# EAGLE design PersiBT (EAGLE 9.1.3)
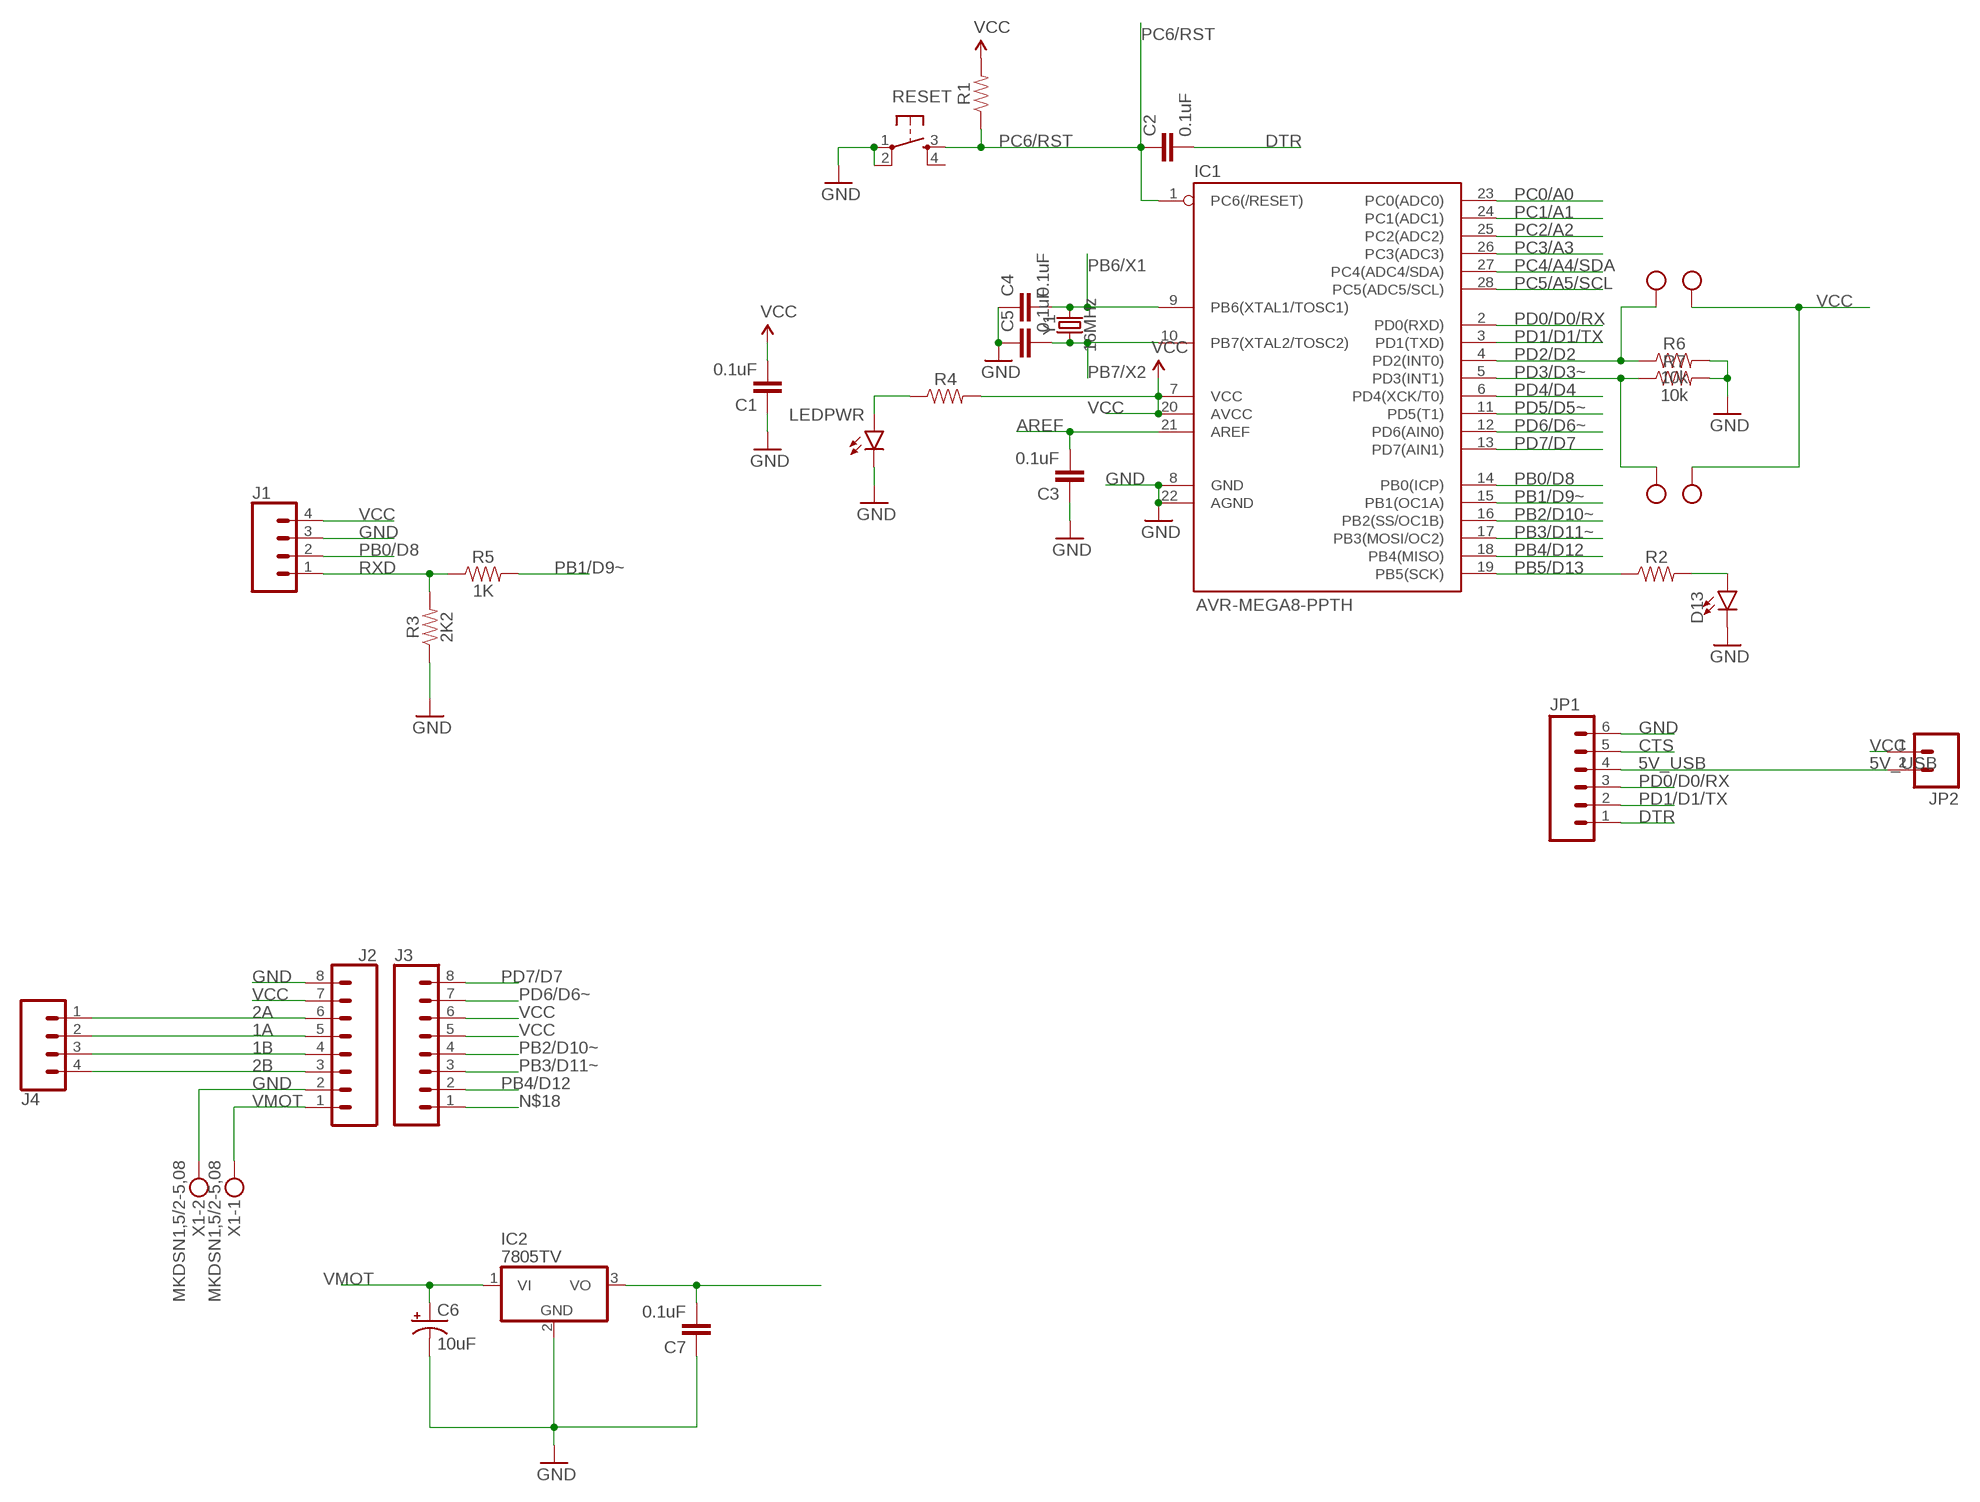
[diagram p0: schematic, sheet 1]

## Parts
C1  0.1uF  0.1UF-KIT-EZ-50V-20%  [CAP-PTH-SMALL-KIT]
C2  0.1uF  0.1UF-KIT-EZ-50V-20%  [CAP-PTH-SMALL-KIT]
C3  0.1uF  0.1UF-KIT-EZ-50V-20%  [CAP-PTH-SMALL-KIT]
C4  0.1uF  0.1UF-KIT-EZ-50V-20%  [CAP-PTH-SMALL-KIT]
C5  0.1uF  0.1UF-KIT-EZ-50V-20%  [CAP-PTH-SMALL-KIT]
C6  10uF  10UF-POLAR-RADIAL-2.5MM-KIT-25V-20%  [CPOL-RADIAL-2.5MM-5MM-KIT]
C7  0.1uF  0.1UF-KIT-EZ-50V-20%  [CAP-PTH-SMALL-KIT]
D13  LED5MM-KIT  [LED_5MM-KIT]
IC1  AVR-MEGA8-PPTH  [DIL28-3]
IC2  7805TV  [TO220V]
J1  CONN_04  [1X04]
J2  CONN_08"  [1X08]
J3  CONN_08"  [1X08]
J4  CONN_04  [1X04]
JP1  M06SIP  [1X06]
JP2  M02PTH  [1X02]
LEDPWR  LED5MM-KIT  [LED_5MM-KIT]
R1  RESISTORAXIAL-0.3-KIT  [AXIAL-0.3-KIT]
R2  RESISTORAXIAL-0.3-KIT  [AXIAL-0.3-KIT]
R3  2K2  RESISTORAXIAL-0.3-KIT  [AXIAL-0.3-KIT]
R4  RESISTORAXIAL-0.3-KIT  [AXIAL-0.3-KIT]
R5  1K  RESISTORAXIAL-0.3-KIT  [AXIAL-0.3-KIT]
R6  10k  RESISTORAXIAL-0.3-KIT  [AXIAL-0.3-KIT]
R7  10k  RESISTORAXIAL-0.3-KIT  [AXIAL-0.3-KIT]
RESET  TAC_SWITCHPTH  [TACTILE-PTH]
X1  MKDSN1,5/2-5,08  [MKDSN1,5/2-5,08]
X2  MKDSN1,5/2-5,08  [MKDSN1,5/2-5,08]
X3  MKDSN1,5/2-5,08  [MKDSN1,5/2-5,08]
Y1  16MHz  CRYSTAL-16MHZPTH-HC49US  [HC49US]

## Nets
1A: J2.5 J4.2
1B: J2.4 J4.3
2A: J2.6 J4.1
2B: J2.3 J4.4
5V_USB: JP1.4 JP2.2
AREF: C3.2 IC1.21(AREF)
CTS: JP1.5
DTR: C2.2 JP1.1
GND: C1.1 C3.1 C4.1 C5.1 C6.2(-) C7.1 D13.K(C) IC1.8(GND) IC1.22(AGND) IC2.2(GND) J1.3 J2.2 J2.8 JP1.6 LEDPWR.K(C) R3.P$1 R6.P$2 R7.P$2 RESET.1 RESET.2 X1.2
N$1: D13.A R2.P$2
N$2: LEDPWR.A R4.P$1
N$18: J3.1
PB0/D8: IC1.14(PB0(ICP)) J1.2
PB1/D9~: IC1.15(PB1(OC1A)) R5.P$2
PB2/D10~: IC1.16(PB2(SS/OC1B)) J3.4
PB3/D11~: IC1.17(PB3(MOSI/OC2)) J3.3
PB4/D12: IC1.18(PB4(MISO)) J3.2
PB5/D13: IC1.19(PB5(SCK)) R2.P$1
PB6/X1: C4.2 IC1.9(PB6(XTAL1/TOSC1)) Y1.2
PB7/X2: C5.2 IC1.10(PB7(XTAL2/TOSC2)) Y1.1
PC0/A0: IC1.23(PC0(ADC0))
PC1/A1: IC1.24(PC1(ADC1))
PC2/A2: IC1.25(PC2(ADC2))
PC3/A3: IC1.26(PC3(ADC3))
PC4/A4/SDA: IC1.27(PC4(ADC4/SDA))
PC5/A5/SCL: IC1.28(PC5(ADC5/SCL))
PC6/RST: C2.1 IC1.1(PC6(/RESET)) R1.P$1 RESET.3
PD0/D0/RX: IC1.2(PD0(RXD)) JP1.3
PD1/D1/TX: IC1.3(PD1(TXD)) JP1.2
PD2/D2: IC1.4(PD2(INT0)) R6.P$1 X2.1
PD3/D3~: IC1.5(PD3(INT1)) R7.P$1 X3.2
PD4/D4: IC1.6(PD4(XCK/T0))
PD5/D5~: IC1.11(PD5(T1))
PD6/D6~: IC1.12(PD6(AIN0)) J3.7
PD7/D7: IC1.13(PD7(AIN1)) J3.8
RXD: J1.1 R3.P$2 R5.P$1
VCC: C1.2 C7.2 IC1.7(VCC) IC1.20(AVCC) IC2.3(VO) J1.4 J2.7 J3.5 J3.6 JP2.1 R1.P$2 R4.P$2 X2.2 X3.1
VMOT: C6.1(+) IC2.1(VI) J2.1 X1.1
Unconnected: RESET.4

## Library data of the parts
C1-C5 C7 = SparkFun-Capacitors:0.1UF: 0.1µF ceramic capacitors A capacitor is a passive two-terminal electrical component used to store electrical energy temporarily in an electric field.; PROD_ID: CAP-08370
C6 = SparkFun-Capacitors:10UF-POLAR: 10.0µF polarized capacitors A capacitor is a passive two-terminal electrical component used to store electrical energy temporarily in an electric field.; PROD_ID: CAP-08440
D13 LEDPWR = SparkFun-LED:LED: LED (Generic) Standard schematic elements and footprints for 5mm, 3mm, 1206, and 0603 sized LEDs. Generic LEDs with no color specified.
IC1 = SparkFun-DigitalIC:AVR-MEGA8-P: MICROCONTROLLER 8 Kbytes FLASH 1 kbytes SRAM 512 bytes EEPROM USART 4-channel 10 bit ADC 2-channel 8 bit ADC
IC2 = linear:78*: Positive VOLTAGE REGULATOR Source: http://cache.national.com/ds/LM/LM78L05.pdf http://www.fairchildsemi.com/ds/LM/LM7805.pdf
J1 J4 = SparkFun-Connectors:CONN_04: Multi connection point. Often used as Generic Header-pin footprint for 0.1 inch spaced/style header connections On any of the 0.1 inch spaced packages, you can populate with these: Break Away Headers - Straight <https://www.sparkfun.com/products/116> (PRT-00116) Break Away Male Headers - Right Angle <https://www.sparkfun.com/products/553> (PRT-00553) Female Headers <https://www.sparkfun.com/products/115> (PRT-00115) Break Away Headers - Machine Pin <https://www.sparkfun.com/products/117> (PRT-00117) Break Away Female Headers - Swiss Machine Pin <https://www.sparkfun.com/products/743> (PRT-00743) For SCREWTERMINALS and SPRING TERMINALS visit here: Screw Terimnals on SparkFun.com <https://www.sparkfun.com/search/results?term=Screw+Terminals> (5mm/3.5mm/2.54mm spacing) This device is also useful as a general connection point to wire up your design to another part of your project. Our various solder wires solder well into these plated through hole pads. Hook-Up Wire - Assortment (Stranded, 22 AWG) <https://www.sparkfun.com/products/11375> (PRT-11375) Hook-Up Wire - Assortment (Solid Core, 22 AWG) <https://www.sparkfun.com/products/11367> (PRT-11367) View the entire wire category on our website here <https://www.sparkfun.com/categories/141> Special notes: Molex polarized connector foot print use with SKU : PRT-08231 with associated crimp pins and housings. 1MM SMD Version SKU: PRT-10208; PROD_ID: CONN-09696
J2 J3 = SparkFun-Connectors:CONN_08: Multi connection point. Often used as Generic Header-pin footprint for 0.1 inch spaced/style header connections On any of the 0.1 inch spaced packages, you can populate with these: Break Away Headers - Straight <https://www.sparkfun.com/products/116> (PRT-00116) Break Away Male Headers - Right Angle <https://www.sparkfun.com/products/553> (PRT-00553) Female Headers <https://www.sparkfun.com/products/115> (PRT-00115) Break Away Headers - Machine Pin <https://www.sparkfun.com/products/117> (PRT-00117) Break Away Female Headers - Swiss Machine Pin <https://www.sparkfun.com/products/743> (PRT-00743) Arduino Stackable Header - 8 Pin <https://www.sparkfun.com/products/9279> (PRT-09279) For SCREWTERMINALS and SPRING TERMINALS visit here: Screw Terimnals on SparkFun.com <https://www.sparkfun.com/search/results?term=Screw+Terminals> (5mm/3.5mm/2.54mm spacing) This device is also useful as a general connection point to wire up your design to another part of your project. Our various solder wires solder well into these plated through hole pads. Hook-Up Wire - Assortment (Stranded, 22 AWG) <https://www.sparkfun.com/products/11375> (PRT-11375) Hook-Up Wire - Assortment (Solid Core, 22 AWG) <https://www.sparkfun.com/products/11367> (PRT-11367) View the entire wire category on our website here <https://www.sparkfun.com/categories/141> Special notes: Molex polarized connector foot print use with SKU : PRT-08231 with associated crimp pins and housings. 1MM SMD Version SKU: PRT-10208 NOTES ON THE VARIANTS LOCK and LOCK_LONGPADS... This footprint was designed to help hold the alignment of a through-hole component (i.e. 6-pin header) while soldering it into place. You may notice that each hole has been shifted either up or down by 0.005 of an inch from it's more standard position (which is a perfectly straight line). This slight alteration caused the pins (the squares in the middle) to touch the edges of the holes. Because they are alternating, it causes a "brace" to hold the component in place. 0.005 has proven to be the perfect amount of "off-center" position when using our standard breakaway headers. Although looks a little odd when you look at the bare footprint, once you have a header in there, the alteration is very hard to notice. Also,if you push a header all the way into place, it is covered up entirely on the bottom side.; PROD_ID: CONN-08438
JP1 = SparkFun:M06: Header 6 Standard 6-pin 0.1" header. Use with straight break away headers (SKU : PRT-00116), right angle break away headers (PRT-00553), swiss pins (PRT-00743), machine pins (PRT-00117), and female headers (PRT-00115). Molex polarized connector foot print use with SKU : PRT-08094 with associated crimp pins and housings. NOTES ON THE VARIANTS LOCK and LOCK_LONGPADS... This footprint was designed to help hold the alignment of a through-hole component (i.e. 6-pin header) while soldering it into place. You may notice that each hole has been shifted either up or down by 0.005 of an inch from it's more standard position (which is a perfectly straight line). This slight alteration caused the pins (the squares in the middle) to touch the edges of the holes. Because they are alternating, it causes a "brace" to hold the component in place. 0.005 has proven to be the perfect amount of "off-center" position when using our standard breakaway headers. Although looks a little odd when you look at the bare footprint, once you have a header in there, the alteration is very hard to notice. Also, if you push a header all the way into place, it is covered up entirely on the bottom side. This idea of altering the position of holes to aid alignment will be further integrated into the Sparkfun Library for other footprints. It can help hold any component with 3 or more connection pins.
JP2 = SparkFun:M02: Header 2 Standard 2-pin 0.1" header. Use with straight break away headers (SKU : PRT-00116), right angle break away headers (PRT-00553), swiss pins (PRT-00743), machine pins (PRT-00117), and female headers (PRT-00115). Molex polarized connector foot print use with SKU : PRT-08233 with associated crimp pins and housings.
R1-R7 = SparkFun-Resistors:RESISTOR: Generic Resistor Package
RESET = SparkFun-Electromechanical:TAC_SWITCH: Momentary Switch Button commonly used for reset or general input. Spark Fun Electronics SKU : COM-00097
X1-X3 = con-phoenix-508:MKDSN1,5/2-5,08: MKDSN 1,5/ 2-5,08 Printklemme Nennstrom: 13,5 A Nennspannung: 250 V Rastermaß: 5,08 mm Polzahl: 2 Anschlussart: Schraubanschluss Montage: Löten Anschlussrichtung Leiter/Platine: 0 ° Artikelnummer: 1729128 Source: http://eshop.phoenixcontact.com .. 1729128.pdf
Y1 = SparkFun-Clocks:CRYSTAL-16MHZ: 16MHz Crystal Digikey Example <http://www.digikey.com/product-search/en?keywords=535-9122-1-ND> Frequency: 16MHz Frequency Stability: ±50ppm Frequency Tolerance: ±20ppm Load Capacitance: 18pF SparkFun Products: Pro Micro -5V/16MHz <https://www.sparkfun.com/products/12640> SparkFun Serial Enabled LCD Kit <https://www.sparkfun.com/products/10097>; PROD_ID: XTAL-08181; SF_ID: COM-00536

## Net classes
0 default: width 0.61 mm, drill 0.9 mm, clearance 0.203 mm

## Board
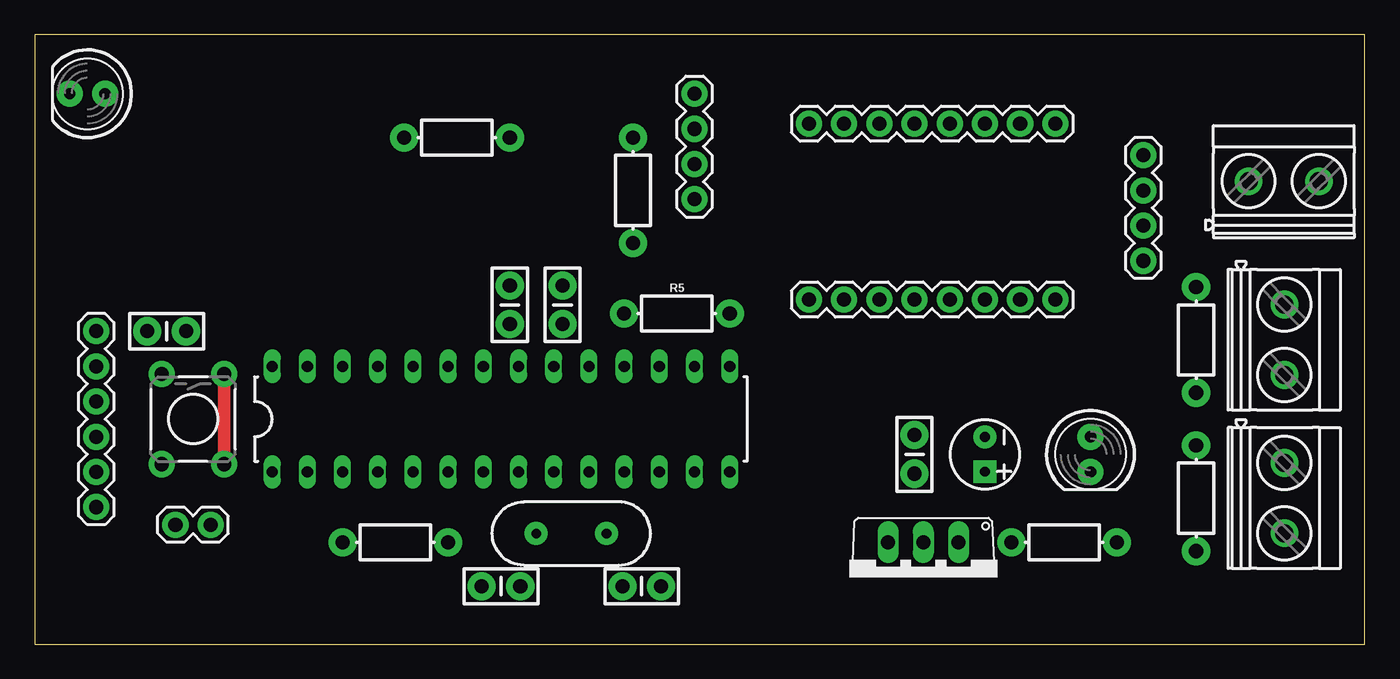
[diagram p1: board, top side]
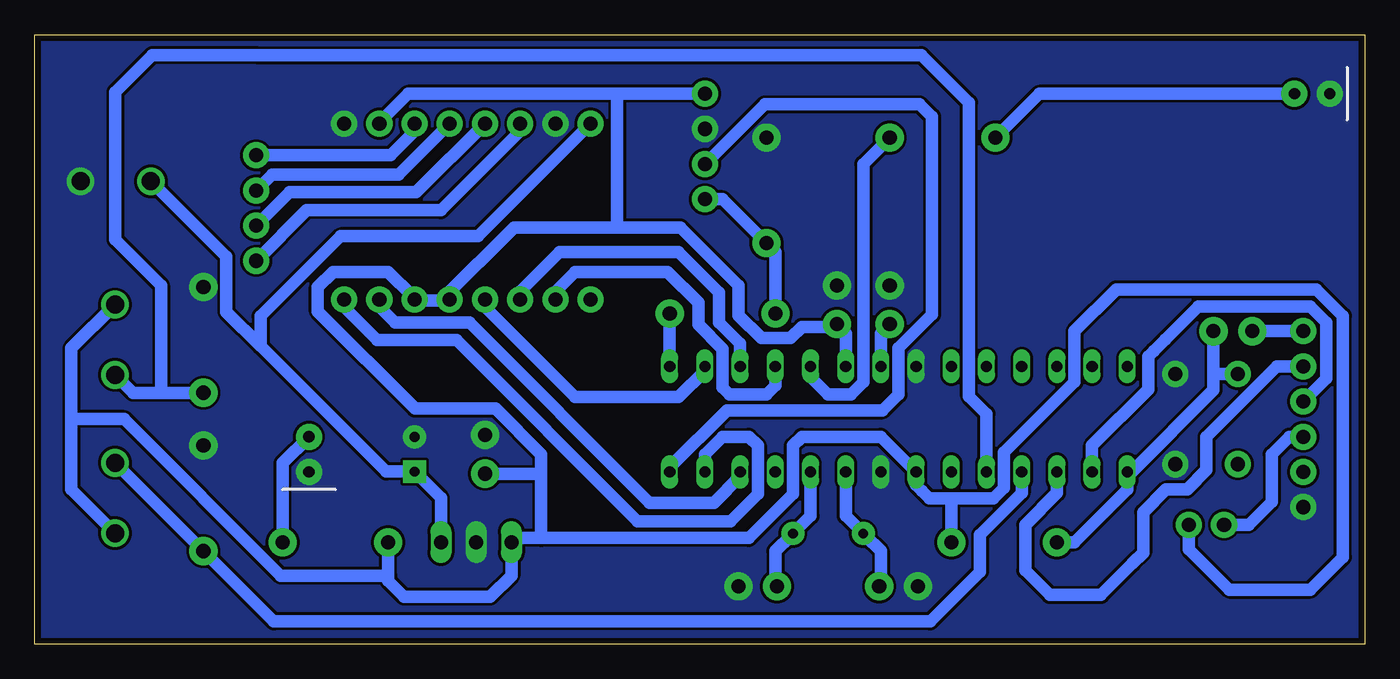
[diagram p2: board, bottom side, seen from below]

Size 96 x 44 mm. Coordinates in mm from the lower left corner, seen from the top.
Outline: 0,0 96,0 96,44 0,44 0,0
Copper layers (1*16): Top 0.017mm / dielectric 1.566mm / Bottom 0.017mm
Design rules "default": minimum track width 4mil, minimum drill 8mil, track to track 4mil, track to pad 4mil, pad to pad 4mil, via to via 4mil, smd to smd 4mil, copper to edge 18mil, drill to drill 9mil, minimum pad ring 5mil, minimum via ring 5mil, stop-mask expansion 2.5mil, vias tented up to drill 0mil, thermal gap 10mil

### Footprints (pad centres in the part's own frame; a part is rotated, then mirrored left to right if it is on the bottom)
CAP-PTH-SMALL-KIT = drill 1.016 pad 2.032: 1 -1.397,0; 2 1.397,0
CPOL-RADIAL-2.5MM-5MM-KIT = drill 0.7 pad 1.651 square: 1 1.25,0 | drill 0.7 pad 1.651: 2 -1.25,0
LED_5MM-KIT = drill 0.813 pad 1.88: A -1.27,0; K 1.27,0
DIL28-3 = drill 0.813 long: 1 -16.51,-3.81; 2 -13.97,-3.81; 3 -11.43,-3.81; 4 -8.89,-3.81; 5 -6.35,-3.81; 6 -3.81,-3.81; 7 -1.27,-3.81; 8 1.27,-3.81; 9 3.81,-3.81; 10 6.35,-3.81; 11 8.89,-3.81; 12 11.43,-3.81; 13 13.97,-3.81; 14 16.51,-3.81; 15 16.51,3.81; 16 13.97,3.81; 17 11.43,3.81; 18 8.89,3.81; 19 6.35,3.81; 20 3.81,3.81; 21 1.27,3.81; 22 -1.27,3.81; 23 -3.81,3.81; 24 -6.35,3.81; 25 -8.89,3.81; 26 -11.43,3.81; 27 -13.97,3.81; 28 -16.51,3.81
TO220V = drill 1.016 long: 1 -2.54,-2.54; 2 0,-2.54; 3 2.54,-2.54
1X04 = drill 1.016 pad 1.88: 1 0,0; 2 2.54,0; 3 5.08,0; 4 7.62,0
1X08 = drill 1.016 pad 1.88: 1 0,0; 2 2.54,0; 3 5.08,0; 4 7.62,0; 5 10.16,0; 6 12.7,0; 7 15.24,0; 8 17.78,0
1X06 = drill 1.016 pad 1.88: 1 0,0; 2 2.54,0; 3 5.08,0; 4 7.62,0; 5 10.16,0; 6 12.7,0
1X02 = drill 1.016 pad 1.88: 1 0,0; 2 2.54,0
AXIAL-0.3-KIT = drill 1.016 pad 2.032: P$1 -3.81,0; P$2 3.81,0
TACTILE-PTH = drill 1.016 pad 1.88: 1 -3.251,2.261; 2 3.251,2.261; 3 -3.251,-2.261; 4 3.251,-2.261
MKDSN1,5/2-5,08 = drill 1.3 pad 2: 1 -2.561,0.025; 2 2.519,0.025
HC49US = drill 0.7 pad 1.651: 1 -2.54,0; 2 2.54,0

### Placement (x,y rotation side)
C1  38.1,24.5 270 top
C2  9.53,22.59 180 top
C3  34.29,24.5 270 top
C4  33.66,4.17 0 top
C5  43.81,4.17 180 top
C6  68.58,13.7 270 top
C7  63.5,13.7 270 top
D13  3.81,39.73 180 top
IC1  33.66,16.24 0 top
IC2  64.14,4.81 180 top
J1  47.62,32.11 90 top
J2  55.88,37.58 0 top
J3  55.88,24.88 0 top
J4  80.01,35.29 270 top
JP1  4.45,22.59 270 top
JP2  12.7,8.62 180 top
LEDPWR  76.2,13.7 270 top
R1  26.04,7.35 0 top
R2  30.48,36.56 180 top
R3  43.18,32.75 270 top
R4  74.3,7.35 180 top
R5  46.35,23.86 0 top
R6  83.82,10.53 90 top
R7  83.82,21.95 90 top
RESET  11.43,16.24 270 top
X1  90.17,33.38 0 top
X2  90.17,10.53 270 top
X3  90.17,21.95 270 top
Y1  38.73,7.99 180 top

### Tracks (layer width: path | path; a pad name or v marks a point on that pad's centre or on a via)
1A
  Bottom 0.9: J2.5 69.72,33.89 78.87,33.89 J4.2
1B
  Bottom 0.9: J2.4 68.45,32.62 77.6,32.62 J4.3
2A
  Bottom 0.9: J4.1 70.33,35.29 68.58,37.04 68.58,37.51 J2.6
2B
  Bottom 0.9: J2.3 60.96,37.51 60.96,37.04 66.67,31.32 76.36,31.32 J4.4
5V_USB
  Bottom 0.9: JP1.4 5.46,14.97 6.73,13.7 6.73,10.27 8.38,8.62 JP2.2
AREF
  Bottom 0.9: IC1.21 34.92,22.43 34.29,23.07 C3.2
DTR
  Bottom 0.9: JP1.1 8.1,22.59 C2.2
GND
  Top 0.9: RESET.2 RESET.1
  pour Bottom (no thermals): 0,0 96,0 96,44 0,44
N$1
  Bottom 0.9: D13.A 23.5,39.73 R2.P$2
N$2
  Bottom 0.9: LEDPWR.A 78.11,13.06 R4.P$1
PB0/D8
  Bottom 0.9: IC1.14 50.16,12.75 46.04,16.88 34.8,16.88 33.66,18.02 33.66,21.37 31.24,23.79 31.24,38.08 32.13,38.97 43.31,38.97 J1.2
PB1/D9~
  Bottom 0.9: R5.P$2 IC1.15
PB2/D10~
  Bottom 0.9: IC1.16 47.62,19.73 49.53,17.83 56.99,17.83 63.5,24.34 63.5,24.81 J3.4
PB3/D11~
  Bottom 0.9: J3.3 60.96,25.45 58.1,28.3 49.53,28.3 46.61,25.38 46.61,23.23 45.09,21.7 IC1.17
PB4/D12
  Bottom 0.9: J3.2 58.42,25.45 56.99,26.88 50.32,26.88 48.1,24.65 48.1,23.07 46.35,21.32 46.35,18.53 45.85,18.02 43.18,18.02 42.55,18.65 IC1.18
PB5/D13
  Bottom 0.9: R2.P$1 36.2,34.66 36.2,19.1 36.2,19.09 36.2,18.92 37.1,18.02 38.73,18.02 40.01,19.29 IC1.19
PB6/X1
  Bottom 0.9: IC1.9 37.47,9.26 Y1.2 36.04,7.83 34.92,6.71 34.92,4.17 C4.2
PB7/X2
  Bottom 0.9: IC1.10 40.01,9.26 Y1.1 41.43,7.83 42.55,6.71 42.55,4.17 C5.2
PC6/RST
  Bottom 0.9: C2.1 10.92,19.41 | 10.92,19.41 10.92,18.34 16.83,12.43 IC1.1 17.14,11.16 20.95,7.35 R1.P$1 | RESET.3 10.85,19.49 10.92,19.41
PD0/D0/RX
  Bottom 0.9: 15.24,21.16 14.4,22 | 14.4,22 12.03,24.37 3.94,24.37 2.79,23.23 2.79,19.16 JP1.3 | IC1.2 19.68,14.34 15.62,18.4 15.62,20.78 14.4,22
PD1/D1/TX
  Bottom 0.9: JP1.2 6.35,20.05 11.43,14.97 11.43,12.56 12.83,11.16 14.35,11.16 16,9.51 16,6.59 16.76,5.83 19.05,3.54 22.73,3.54 24.51,5.32 24.51,8.62 22.23,10.91 IC1.3
PD2/D2
  Bottom 0.9: X2.1 R6.P$1 78.74,1.64 31.37,1.64 27.78,5.22 27.78,7.89 24.77,10.91 IC1.4
PD3/D3~
  Bottom 0.9: IC1.5 27.3,16.62 28.57,17.89 28.57,39.1 32,42.53 80.01,42.53 | 80.01,42.53 | R7.P$1 86.74,18.14 | 86.74,18.14 88.9,18.14 X3.2 | 86.74,18.14 86.87,18.27 86.87,25.89 90.17,29.19 90.17,39.86 87.5,42.53 80.01,42.53
PD6/D6~
  Bottom 0.9: IC1.12 45.09,12.11 46.99,10.21 51.63,10.21 64.63,23.21 69.99,23.21 71.12,24.34 J3.7
PD7/D7
  Bottom 0.9: J3.8 73.66,24.81 73.66,24.34 71.28,21.95 65.56,21.95 52.48,8.87 45.78,8.87 43.81,10.84 43.81,14.34 44.45,14.97 46.35,14.97 47.62,13.7 IC1.13
RXD
  Bottom 0.9: J1.1 46.35,32.11 R3.P$2 43.02,28.78 42.55,28.3 R5.P$1
VCC
  Bottom 0.9: IC1.20 37.47,22.43 38.1,23.07 C1.2 38.26,22.91 40.64,22.91 41.47,22.08 43.56,22.08 45.21,23.73 45.21,25.89 49.4,30.08 53.98,30.08 | J2.7 71.12,37.67 69.06,39.73 53.98,39.73 | J1.4 53.98,39.73 | 59.44,7.67 44.45,7.67 41.27,10.84 41.27,14.34 40.64,14.97 34.92,14.97 IC1.7 32.38,11.48 31.97,11.06 31.43,10.53 29.84,10.53 | 59.44,7.67 61.53,7.67 61.59,7.73 IC2.3 61.59,4.94 63.12,3.41 69.34,3.41 70.48,4.56 70.48,4.94 | 59.44,12.43 59.44,13.7 62.74,17 68.55,17 75.56,24.02 75.56,25.77 74.45,26.88 70.48,26.88 68.74,25.13 J3.6 68.58,24.81 66.04,24.81 J3.5 66.52,24.97 61.4,30.08 53.98,30.08 | 59.44,12.43 59.44,7.67 | C7.2 59.56,12.3 59.44,12.43 | 70.48,4.94 R4.P$2 | 70.48,4.94 78.23,4.94 89.53,16.24 93.34,16.24 | 53.98,39.73 53.98,30.08 | JP2.1 12.7,6.84 9.78,3.92 3.94,3.92 1.59,6.27 1.59,23.7 3.49,25.61 17.94,25.61 20.95,22.59 20.95,18.91 26.04,13.83 26.04,11.29 26.8,10.53 29.84,10.53 | R1.P$2 29.84,10.53 | X3.1 93.34,21.37 93.34,16.24 | 93.34,16.24 93.34,11.16 X2.2
VMOT
  Bottom 0.9: IC2.1 66.67,10.54 C6.1 70.63,12.45 79.69,21.51 | J2.1 64.01,29.45 73.91,29.45 79.69,23.67 79.69,21.51 | 79.69,21.51 82.17,23.99 82.17,27.97 X1.1